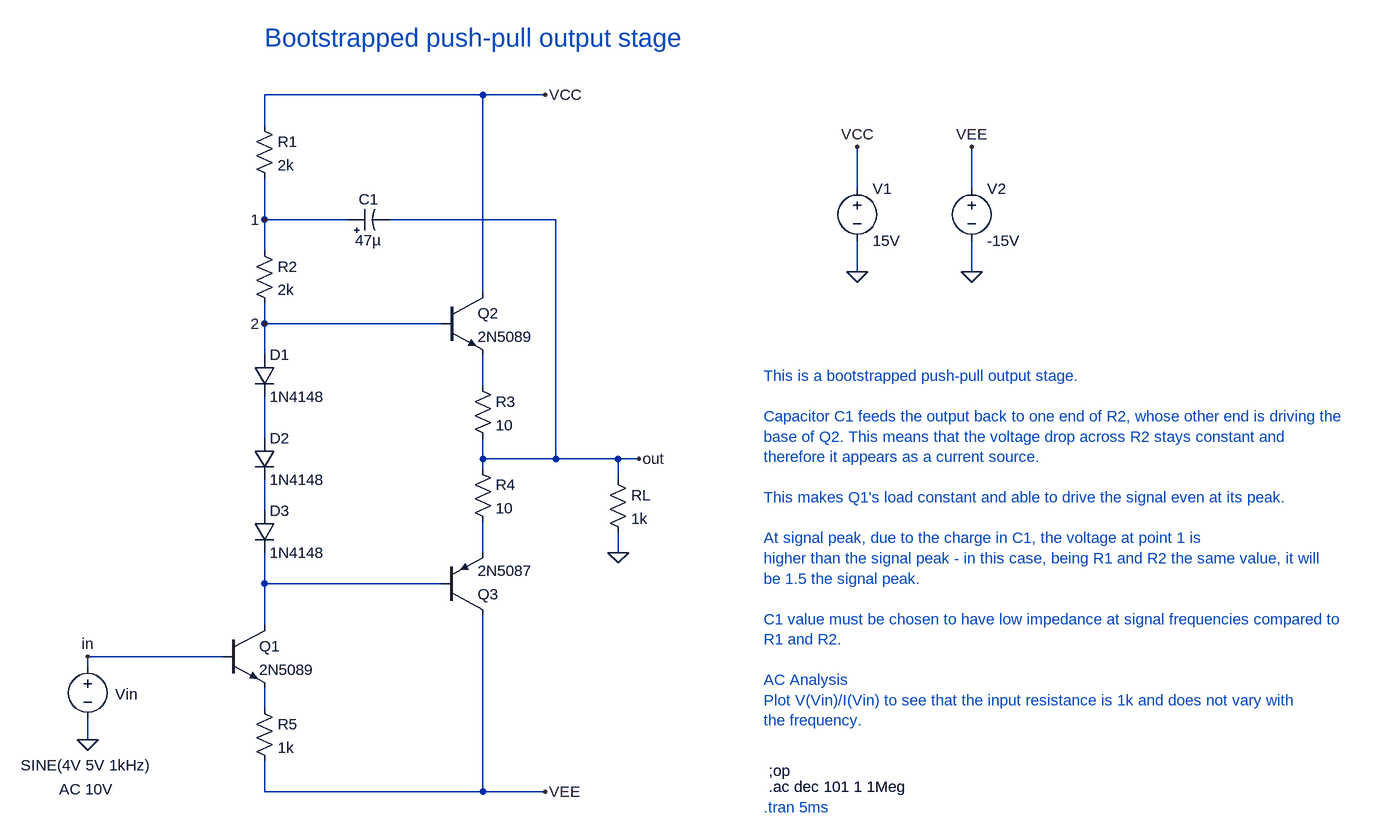
[diagram p0: schematic Figure2.66.asc]
Figure2.66.asc, the LTspice schematic file:
Version 4
SHEET 1 2240 1248
WIRE 384 -64 48 -64
WIRE 480 -64 384 -64
WIRE 48 -16 48 -64
WIRE 960 80 960 16
WIRE 1136 80 1136 16
WIRE 48 128 48 64
WIRE 176 128 48 128
WIRE 496 128 240 128
WIRE 48 176 48 128
WIRE 960 208 960 160
WIRE 1136 208 1136 160
WIRE 384 240 384 -64
WIRE 48 288 48 256
WIRE 320 288 48 288
WIRE 48 336 48 288
WIRE 384 384 384 336
WIRE 48 464 48 400
WIRE 384 496 384 464
WIRE 496 496 496 128
WIRE 496 496 384 496
WIRE 592 496 496 496
WIRE 624 496 592 496
WIRE 384 512 384 496
WIRE 592 528 592 496
WIRE 48 576 48 528
WIRE 384 640 384 592
WIRE 592 640 592 608
WIRE 48 688 48 640
WIRE 320 688 48 688
WIRE 48 752 48 688
WIRE -16 800 -224 800
WIRE -224 816 -224 800
WIRE 48 880 48 848
WIRE -224 928 -224 896
WIRE 48 1008 48 960
WIRE 384 1008 384 736
WIRE 384 1008 48 1008
WIRE 480 1008 384 1008
FLAG 960 208 0
FLAG 1136 208 0
FLAG 960 16 VCC
FLAG 1136 16 VEE
FLAG 624 496 out
FLAG 480 -64 VCC
FLAG 480 1008 VEE
FLAG -224 928 0
FLAG 48 128 1
FLAG 48 288 2
FLAG 592 640 0
FLAG -224 800 in
SYMBOL res 32 -32 R0
SYMATTR InstName R1
SYMATTR Value 2k
SYMBOL res 32 160 R0
SYMATTR InstName R2
SYMATTR Value 2k
SYMBOL res 368 368 R0
SYMATTR InstName R3
SYMATTR Value 10
SYMBOL res 368 496 R0
SYMATTR InstName R4
SYMATTR Value 10
SYMBOL res 32 864 R0
SYMATTR InstName R5
SYMATTR Value 1k
SYMBOL diode 32 336 R0
SYMATTR InstName D1
SYMATTR Value 1N4148
SYMBOL diode 32 464 R0
SYMATTR InstName D2
SYMATTR Value 1N4148
SYMBOL diode 32 576 R0
SYMATTR InstName D3
SYMATTR Value 1N4148
SYMBOL npn -16 752 R0
SYMATTR InstName Q1
SYMATTR Value 2N5089
SYMBOL npn 320 240 R0
SYMATTR InstName Q2
SYMATTR Value 2N5089
SYMBOL pnp 320 736 M180
SYMATTR InstName Q3
SYMATTR Value 2N5087
SYMBOL voltage 960 64 R0
WINDOW 123 0 0 Left 0
WINDOW 39 0 0 Left 0
SYMATTR InstName V1
SYMATTR Value 15V
SYMBOL voltage 1136 64 R0
WINDOW 123 0 0 Left 0
WINDOW 39 0 0 Left 0
SYMATTR InstName V2
SYMATTR Value -15V
SYMBOL voltage -224 800 R0
WINDOW 123 -44 204 Left 2
WINDOW 39 0 0 Left 0
WINDOW 3 -103 167 Left 2
WINDOW 0 42 58 Left 2
SYMATTR Value2 AC 10V
SYMATTR Value SINE(4V 5V 1kHz)
SYMATTR InstName Vin
SYMBOL polcap 176 144 R270
WINDOW 0 32 32 VTop 2
WINDOW 3 0 32 VBottom 2
SYMATTR InstName C1
SYMATTR Value 47µ
SYMBOL res 576 512 R0
SYMATTR InstName RL
SYMATTR Value 1k
TEXT 48 -152 Left 4 ;Bootstrapped push-pull output stage
TEXT 816 368 Left 2 ;This is a bootstrapped push-pull output stage. \n \nCapacitor C1 feeds the output back to one end of R2, whose other end is driving the \nbase of Q2. This means that the voltage drop across R2 stays constant and \ntherefore it appears as a current source.\n \nThis makes Q1's load constant and able to drive the signal even at its peak.\n \nAt signal peak, due to the charge in C1, the voltage at point 1 is\nhigher than the signal peak - in this case, being R1 and R2 the same value, it will\nbe 1.5 the signal peak.\n \nC1 value must be chosen to have low impedance at signal frequencies compared to\nR1 and R2.\n \nAC Analysis\nPlot V(Vin)/I(Vin) to see that the input resistance is 1k and does not vary with \nthe frequency.
TEXT 824 1000 Left 2 !.ac dec 101 1 1Meg
TEXT 824 976 Left 2 !;op
TEXT 816 1032 Left 2 ;.tran 5ms

The netlist it stands for:
* Figure2.66.asc
R1 VCC 1 2k
R2 1 2 2k
R3 N001 out 10
R4 out N004 10
R5 N006 VEE 1k
D1 2 N002 1N4148
D2 N002 N003 1N4148
D3 N003 N005 1N4148
Q1 N005 in N006 0 2N5089
Q2 VCC 2 N001 0 2N5089
Q3 VEE N005 N004 0 2N5087
V1 VCC 0 15V
V2 VEE 0 -15V
Vin in 0 SINE(4V 5V 1kHz) AC 10V
C1 1 out 47µ
RL out 0 1k
.model D D
.lib standard.dio
.model NPN NPN
.model PNP PNP
.lib standard.bjt
* Bootstrapped push-pull output stage
* This is a bootstrapped push-pull output stage.
* Capacitor C1 feeds the output back to one end of R2, whose other end is driving the
* base of Q2. This means that the voltage drop across R2 stays constant and
* therefore it appears as a current source.
* This makes Q1's load constant and able to drive the signal even at its peak.
* At signal peak, due to the charge in C1, the voltage at point 1 is
* higher than the signal peak - in this case, being R1 and R2 the same value, it will
* be 1.5 the signal peak.
* C1 value must be chosen to have low impedance at signal frequencies compared to
* R1 and R2.
* AC Analysis
* Plot V(Vin)/I(Vin) to see that the input resistance is 1k and does not vary with
* the frequency.
.ac dec 101 1 1Meg
;op
* .tran 5ms
.backanno
.end